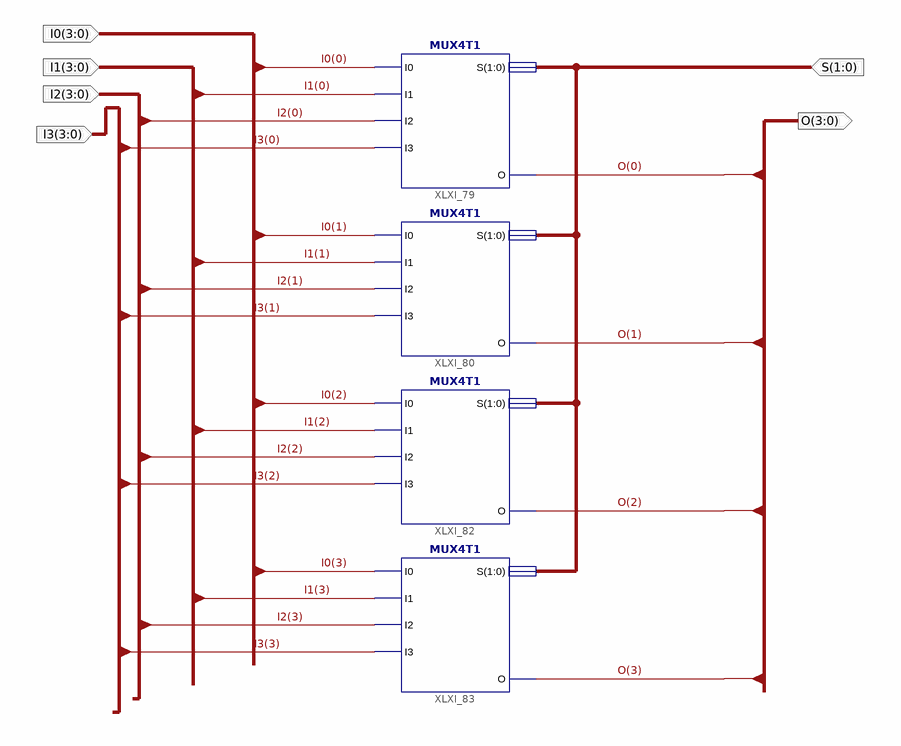
[diagram p0: schematic sheet 1]
// Xilinx ISE schematic MUX441.sch (kintex7) as structural Verilog: 4 symbols, 6 ports
module MUX441 (
  input  [3:0] I0,
  input  [3:0] I1,
  input  [3:0] I2,
  input  [3:0] I3,
  input  [1:0] S,
  output [3:0] O
);

  MUX4T1 XLXI_79 (.S(S), .I0(I0[0]), .I1(I1[0]), .I2(I2[0]), .I3(I3[0]), .O(O[0]));
  MUX4T1 XLXI_80 (.S(S), .I0(I0[1]), .I1(I1[1]), .I2(I2[1]), .I3(I3[1]), .O(O[1]));
  MUX4T1 XLXI_82 (.S(S), .I0(I0[2]), .I1(I1[2]), .I2(I2[2]), .I3(I3[2]), .O(O[2]));
  MUX4T1 XLXI_83 (.S(S), .I0(I0[3]), .I1(I1[3]), .I2(I2[3]), .I3(I3[3]), .O(O[3]));
endmodule
